# EAGLE board psion (EAGLE 9.5.0), part 1 of 2
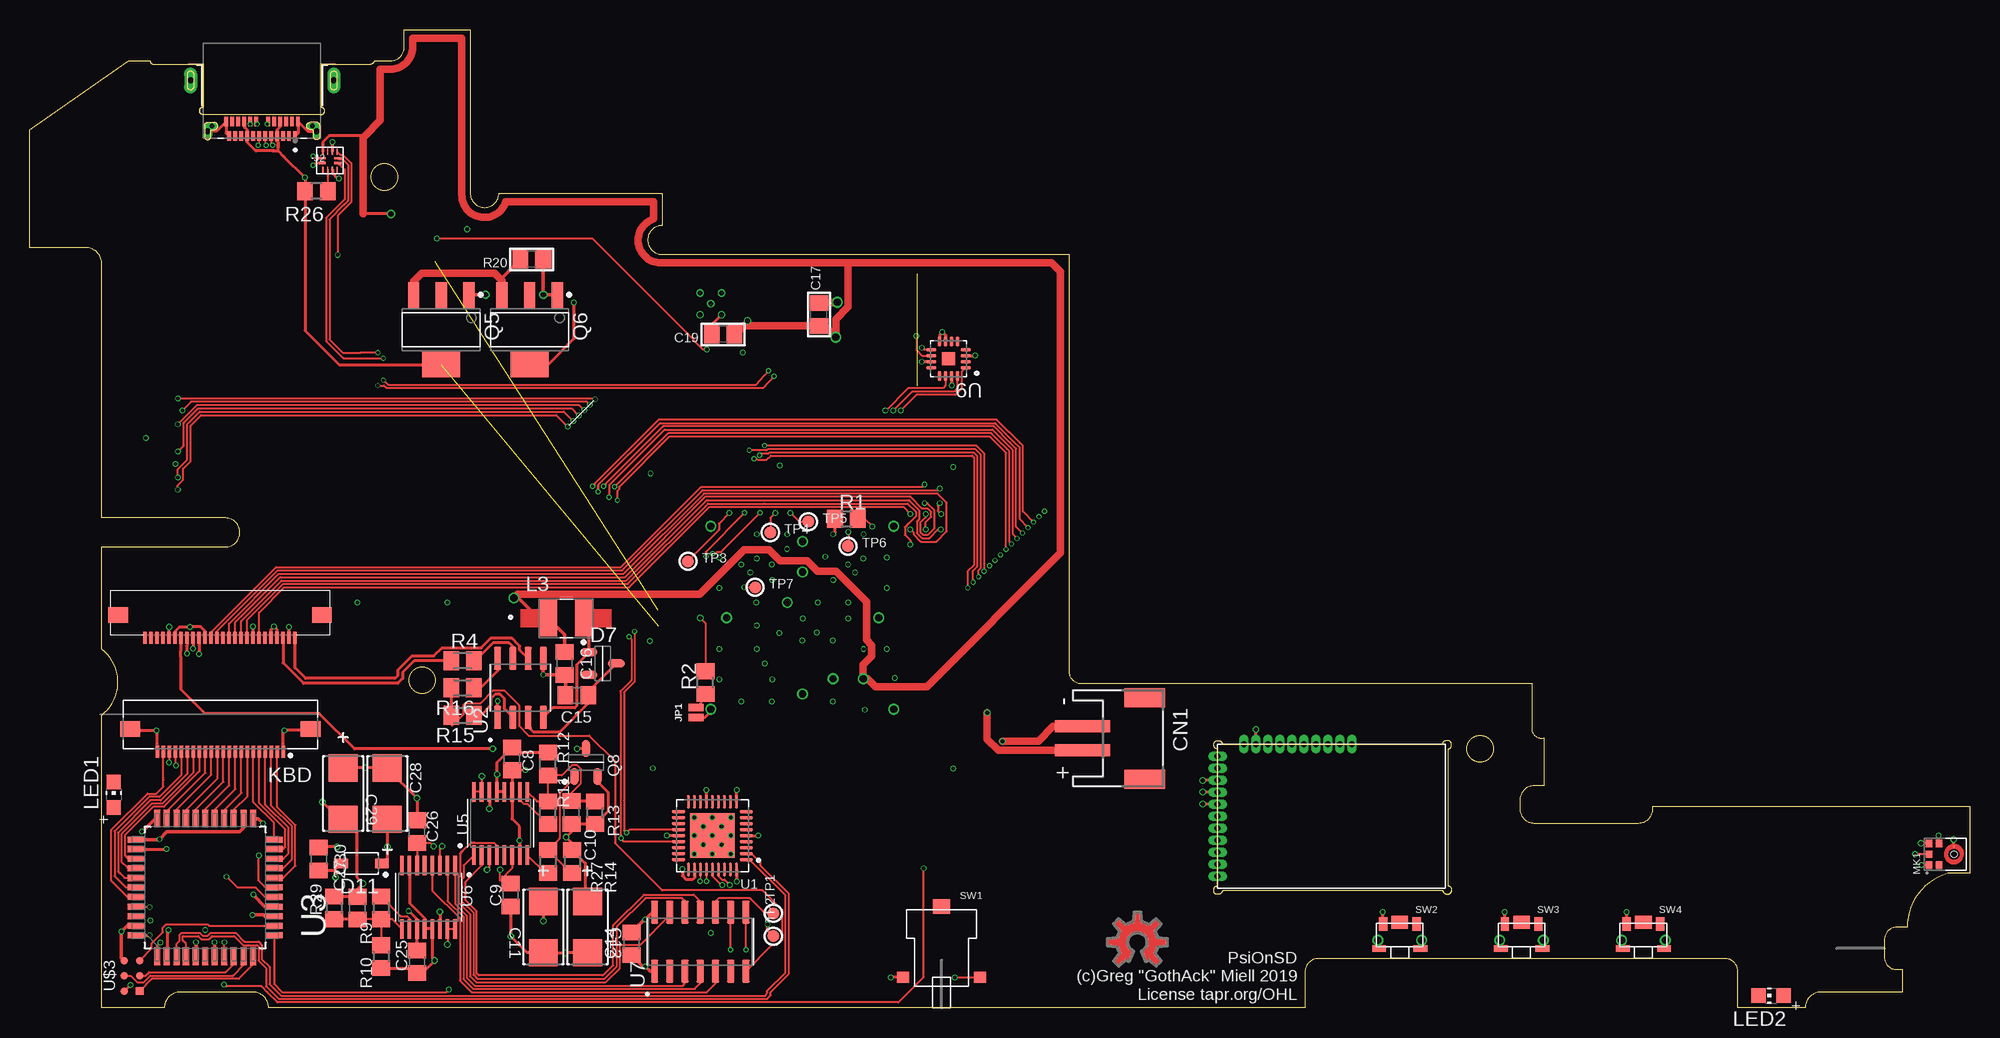
[diagram p6: board, top side]
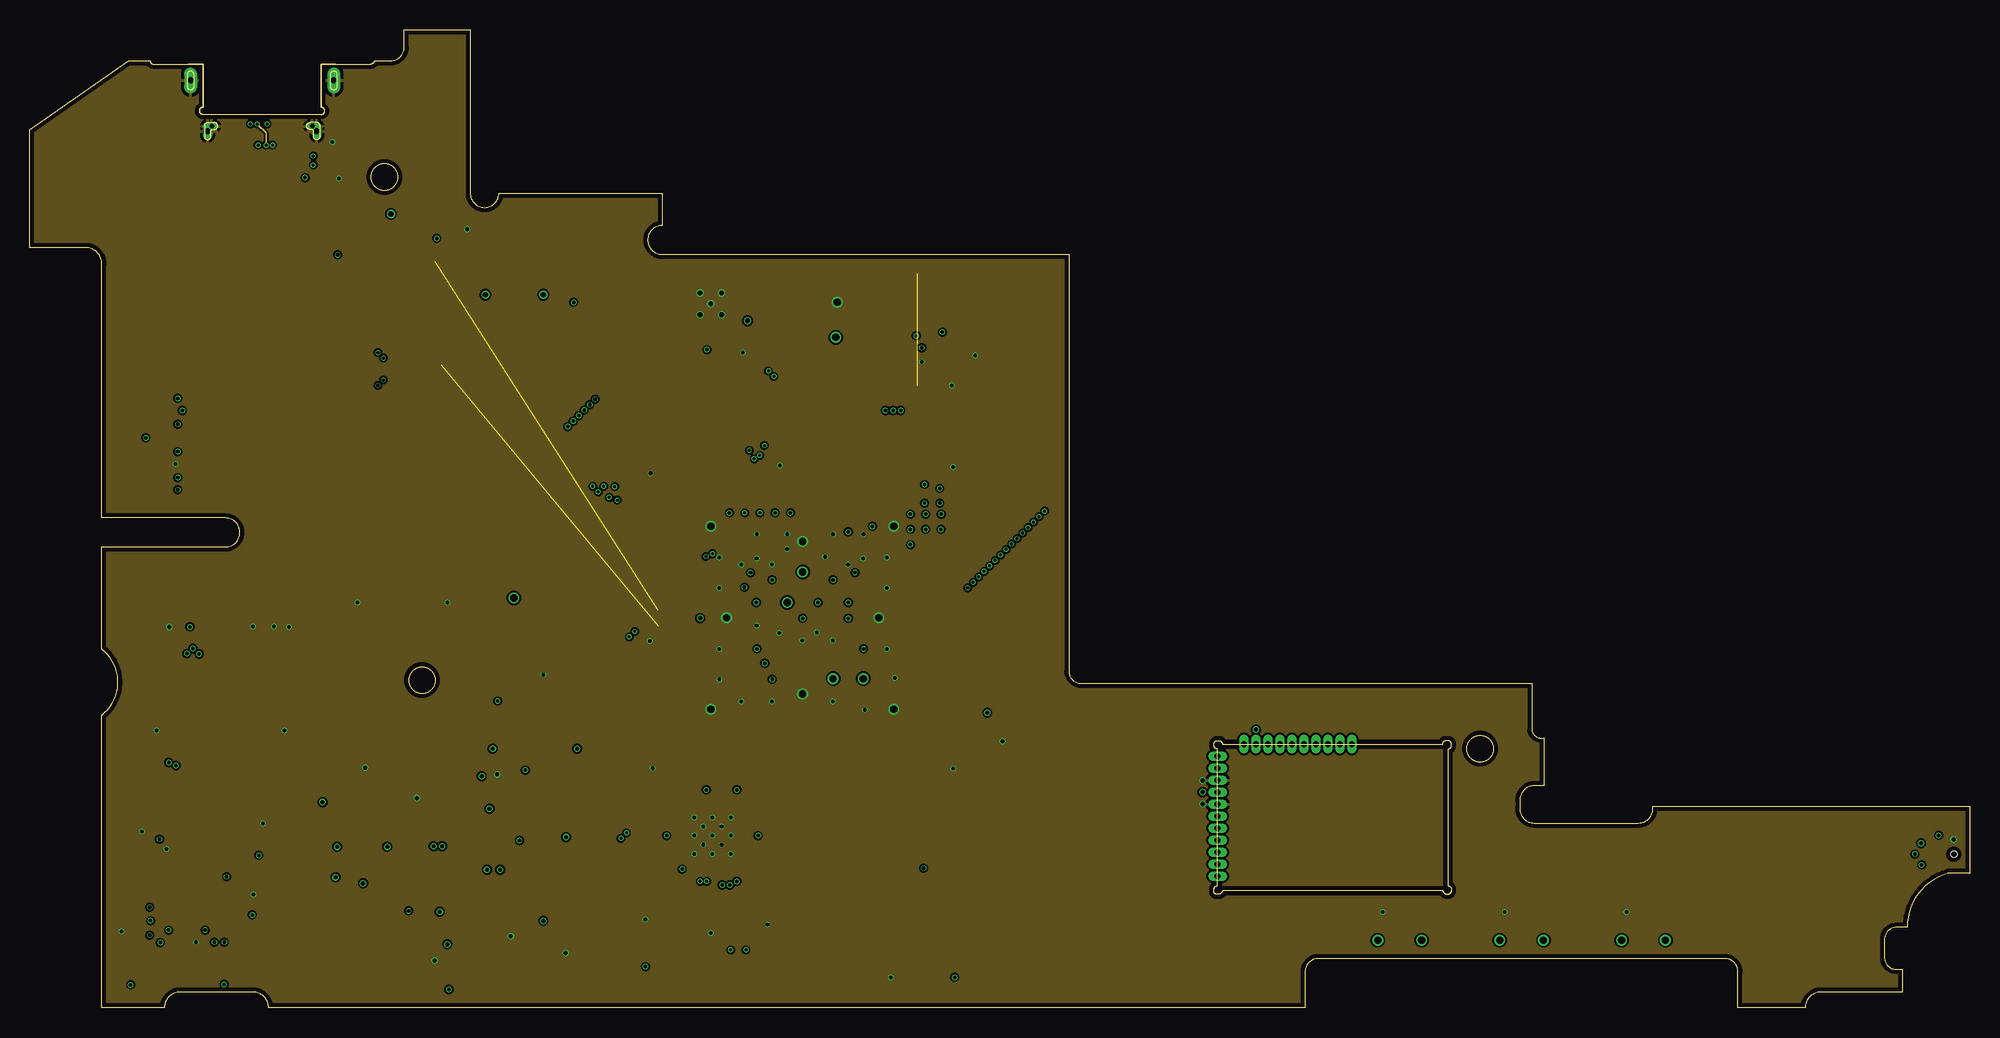
[diagram p7: board, inner layer GroundPlane]
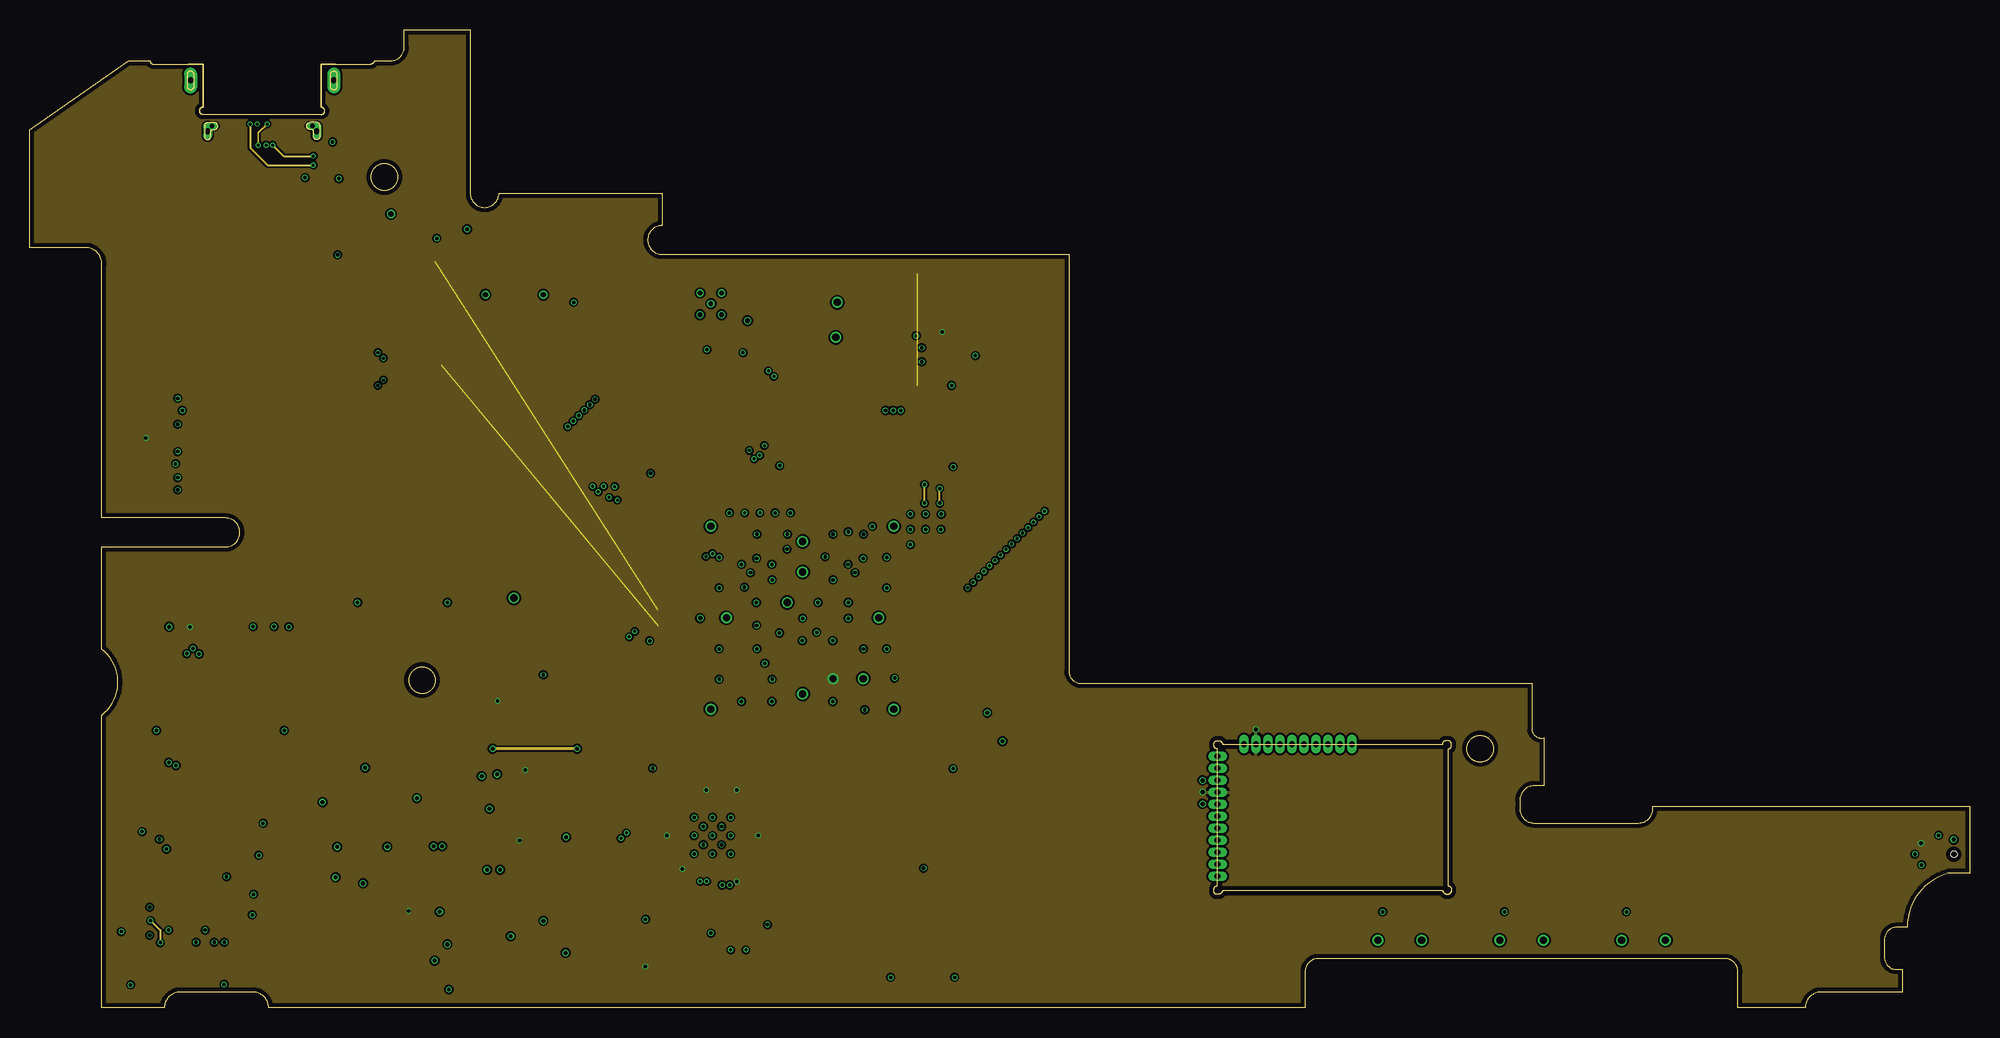
[diagram p8: board, inner layer VCC33/signal]
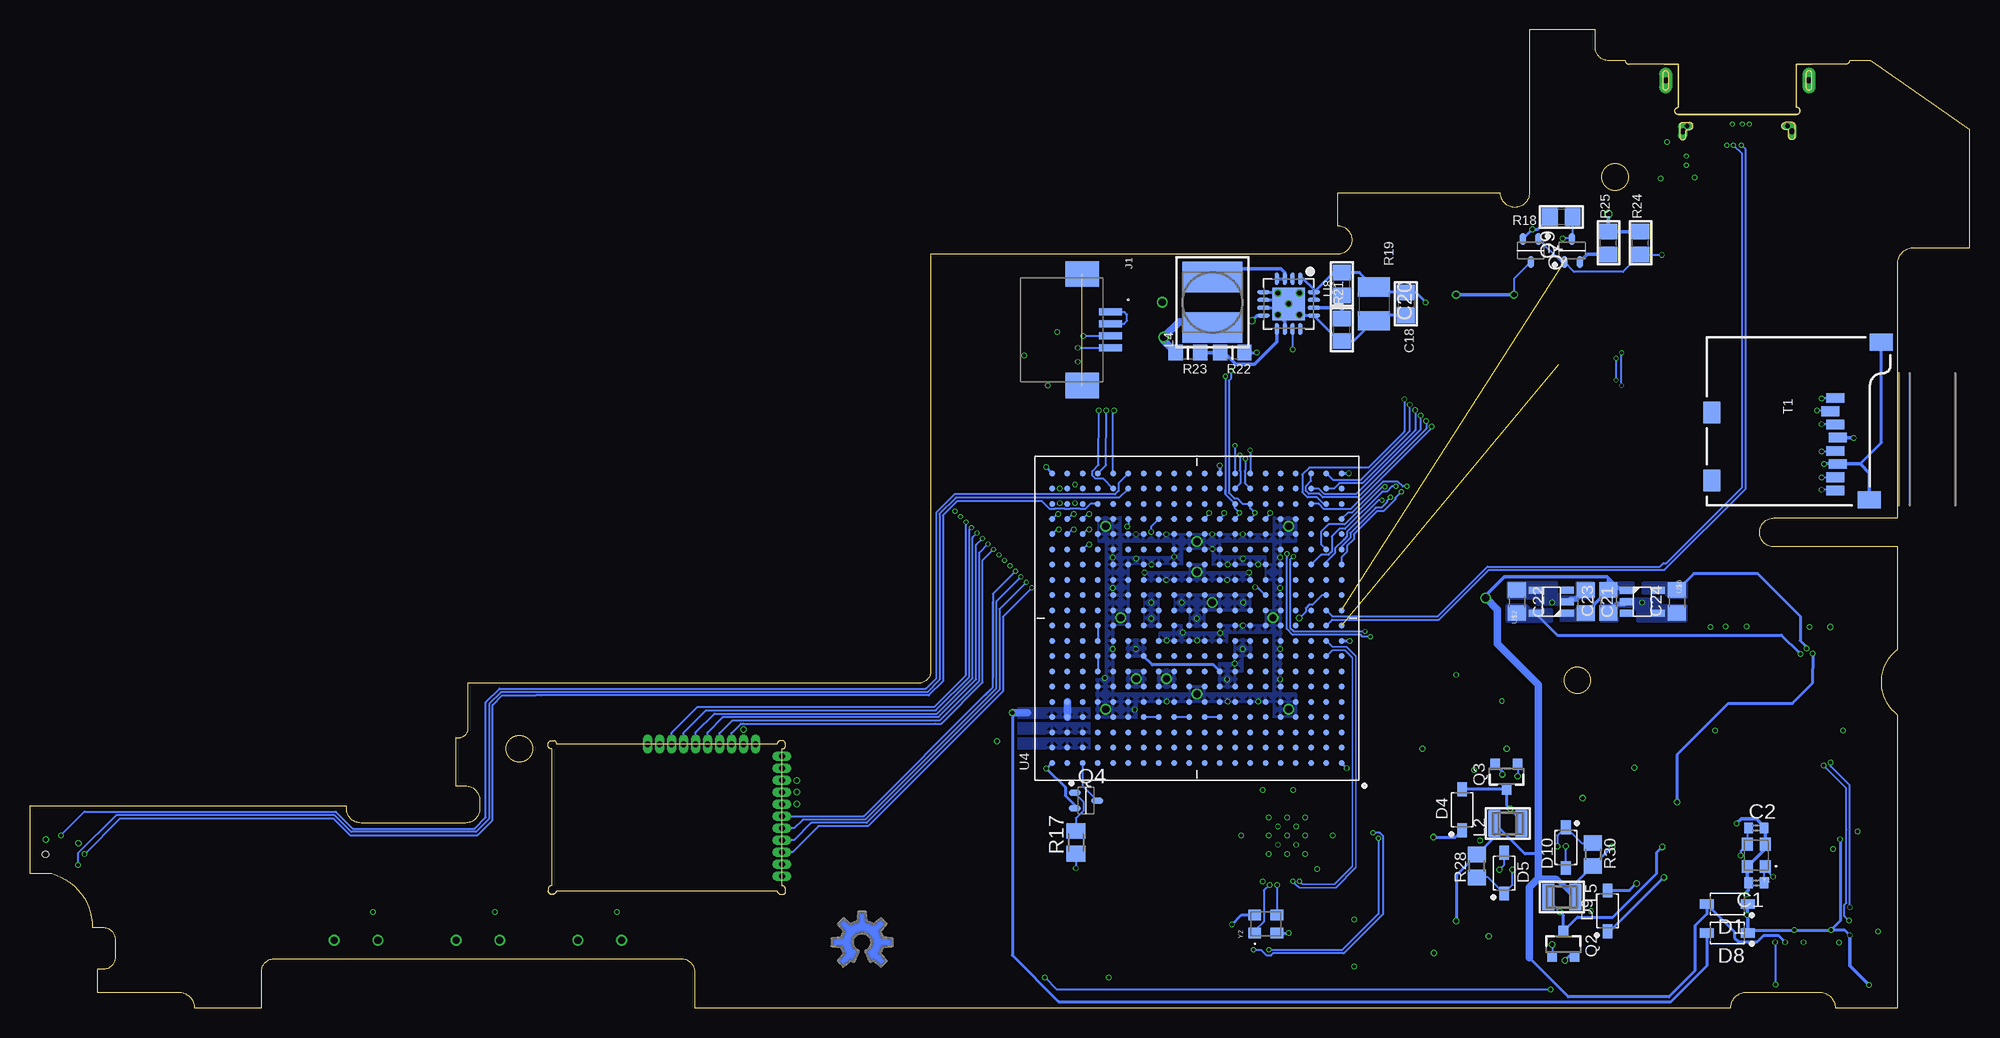
[diagram p9: board, bottom side, seen from below]

Size 161.7 x 81.5 mm. Coordinates in mm from the lower left corner, seen from the top.
Outline: 8.24,78.95 0,73.2 0,63.35 4.65,63.35 arc-90 6,62 6,40.83 16.3,40.83 arc-180 16.3,38.42 6,38.42 6,29.9 arc-104 6,24.4 6,0 11.2,0 arc-90 12.5,1.3 18.6,1.3 arc-90 19.9,0 106.3,0 106.3,3 arc-90 107.4,4.1 141.3,4.1 arc-90 142.4,3 142.4,0 148,0 arc-90 149.3,1.3 156.1,1.3 156.1,3.2 155.6,3.2 arc-90 154.6,4.2 154.6,5.7 arc-90 155.6,6.7 156.5,6.7 arc-74 159.88,11.2 161.7,11.2 161.7,16.8 135.3,16.8 135.3,16.6 arc-90 134.1,15.4 125.4,15.4 arc-90 124.2,16.6 124.2,17.3 arc-90 125.4,18.5 126.2,18.5 126.2,22.5 arc-90 125.2,23.12 125.2,27.05 87.61,27.05 arc-90 86.61,28.05 86.61,62.8 52.7,62.8 arc-180 52.7,65.2 52.7,67.9 39.1,67.9 arc-180 36.7,67.9 36.7,81.5 31.2,81.5 31.2,80.05 arc-90 30.1,78.95 28.7,78.95 arc-90 28.4,78.65 24.27,78.65 24.27,75.06 arc-90 24.57,74.76 arc-90 24.27,74.46 14.43,74.46 arc-90 14.13,74.76 14.13,74.77 arc-90 14.42,75.06 14.43,75.06 14.43,78.65 10.3,78.65 arc-90 10,78.95 8.24,78.95
Outline: 8.21,78.95 8.24,78.95
Outline: circle at 29.55,69.25 radius 1.1
Outline: circle at 32.69,27.31 radius 1.1
Outline: circle at 120.9,21.6 radius 1.1
Copper layers (1*2*15*16): Top 0.035559375mm / dielectric 0.17018125mm / GroundPlane 0.01778125mm / dielectric 47mil / VCC33/signal 0.01778125mm / dielectric 0.17018125mm / Bottom 0.035559375mm
Design rules "oshpark-4layer *": minimum track width 5mil, minimum drill 10mil, track to track 5mil, track to pad 5mil, pad to pad 5mil, via to via 5mil, smd to smd 5mil, copper to edge 15mil, drill to drill 6mil, minimum pad ring 3mil, minimum via ring 3mil, stop-mask expansion 2.5mil, vias tented up to drill 0mil, thermal gap 10mil
Net classes: 0 default: width 0.152 mm, drill 0.254 mm, clearance 0.089 mm; 1 data: width 0.152 mm, drill 0.254 mm, clearance 0.089 mm; 2 power: width 0.254 mm, drill 0.254 mm, clearance 0.152 mm; 3 data_usb: width 0.127 mm, drill 0.254 mm, clearance 0.089 mm; 4 data_lcd: width 0.152 mm, drill 0.254 mm, clearance 0.089 mm; 5 data_lowspeed: width 0.152 mm, drill 0.254 mm, clearance 0.089 mm

## Footprints (pad centres in the part's own frame; a part is rotated, then mirrored left to right if it is on the bottom)
C0402 = smd 0.7 x 0.9: 1 -0.65,0; 2 0.65,0
C805 = smd 1.3 x 1.5: 1 -0.95,0; 2 0.95,0
CAPCP6032X280N = smd 2.261 x 2.413: N 2.134,0; P -2.134,0
0805 = smd 1.3 x 1.5: 1 -0.95,0; 2 0.95,0
C1210 = smd 1.6 x 2.7: 1 -1.4,0; 2 1.4,0
JST-PH-2-SMT-RA = smd 1 x 4.6: 1 1,-3.7; 2 -1,-3.7 | smd 1.6 x 3.4: NC1 -3.4,1.5; NC2 3.4,1.5
SOD3718X135N = smd 1.15 x 0.8: A 1.7,0; K -1.7,0
SOT95P280X135-3N = smd 1.4 x 0.65: 1 -1.15,0.95; 2 -1.15,-0.95; 3 1.15,0
MOLEX_0522070433 = smd 0.6 x 1.9: 1 -1.5,0; 2 -0.5,0; 3 0.5,0; 4 1.5,0 | smd 2.1 x 2.8: S1 -4.65,-2.35; S2 4.65,-2.35
TE_1-2295018-2 = smd 0.3 x 0.8: A1 -2.75,4.63; A2 -2.25,4.63; A3 -1.75,4.63; A4 -1.25,4.63; A5 -0.75,4.63; A6 -0.25,4.63; A7 0.25,4.63; A8 0.75,4.63; A9 1.25,4.63; A10 1.75,4.63; A11 2.25,4.63; A12 2.75,4.63; B1 3,3.43; B2 2.5,3.43; B3 2,3.43; B4 1.5,3.43; B5 1,3.43; B6 0.5,3.43; B7 -0.5,3.43; B8 -1,3.43; B9 -1.5,3.43; B10 -2,3.43; B11 -2.5,3.43; B12 -3,3.43 | drill 0.5 long: P1_1 -4.55,4.22; P2_1 4.55,4.22 | drill 0.35 long: P1_2 -4.191,3.795; P2_2 4.191,3.795 | drill 0.5 pad 1.1 long: P4 -5.97,0; P5 5.97,0
SMT-JUMPER_2_NO_NO-SILK = smd 0.635 x 1.27: 1 -0.406,0; 2 0.406,0
MOLEX_54548-2271 = smd 0.3 x 1: 1 -5.25,0; 2 -4.75,0; 3 -4.25,0; 4 -3.75,0; 5 -3.25,0; 6 -2.75,0; 7 -2.25,0; 8 -1.75,0; 9 -1.25,0; 10 -0.75,0; 11 -0.25,0; 12 0.25,0; 13 0.75,0; 14 1.25,0; 15 1.75,0; 16 2.25,0; 17 2.75,0; 18 3.25,0; 19 3.75,0; 20 4.25,0; 21 4.75,0; 22 5.25,0 | smd 1.65 x 1.3: SH1 -7.525,-1.9; SH2 7.525,-1.9
INDUCTOR_1007 = smd 1.016 x 2.2: P$1 -1.127,0; P$2 1.127,0
IND_LQH43CN1R0M03L = smd 1.5 x 3: 1 -1.5,0; 2 1.5,0
INDUCTOR_5X5MM_TDK_VLC5045 = smd 2.54 x 5: P$1 -2.096,0; P$2 2.096,0
0545502671 = smd 0.3 x 1: 1 6.1,4.1; 2 6.6,4.1; 3 7.1,4.1; 4 7.6,4.1; 5 8.1,4.1; 6 8.6,4.1; 7 9.1,4.1; 8 9.6,4.1; 9 10.1,4.1; 10 10.6,4.1; 11 11.1,4.1; 12 11.6,4.1; 13 12.1,4.1; 14 12.6,4.1; 15 13.1,4.1; 16 13.6,4.1; 17 14.1,4.1; 18 14.6,4.1; 19 15.1,4.1; 20 15.6,4.1; 21 16.1,4.1; 22 16.6,4.1; 23 17.1,4.1; 24 17.6,4.1; 25 18.1,4.1; 26 18.6,4.1 | smd 1.65 x 1.3: 27 3.85,2.2; 28 20.85,2.2
CHIP-LED0805 = smd 1.2 x 1.2: A 0,-1.05; C 0,1.05
MIC_SPH0645LM4H-B = smd 0.6 x 0.522: 1 -0.9,2.074; 2 -0.9,1.252; 4 0.9,1.252; 5 0.9,2.074; 6 0,2.074 | smd 0.1 x 0.1: 3 0.65,0.02 | hole 0.5: 0,0
SOT23-3 = smd 0.8 x 0.9: 1 -0.95,-1; 2 0.95,-1; 3 0,1.1
SOT65P210X110-3N = smd 1 x 0.55: 1 -0.95,0.65; 2 -0.95,-0.65; 3 0.95,0
SOT230P700X160-4N = smd 2.15 x 0.95: 1 -2.9,2.3; 2 -2.9,0; 3 -2.9,-2.3 | smd 2.15 x 3.15: 4 2.9,0
R0805 = smd 1.3 x 1.5: 1 -0.95,0; 2 0.95,0
M0805 = smd 1.3 x 1.6: 1 -0.95,0; 2 0.95,0
_0805MP = smd 1.2 x 1.3: 1 -1.016,0; 2 1.016,0
KSM1131 = smd 1 x 0.9: 1 -3.2,0; 2 3.2,0 | smd 1.4 x 1.2: NC 0,5.9
LS12T2-T = smd 0.7 x 1.1: 1 -1.4,1.9; 2 1.4,1.9 | smd 1.4 x 1.1: NC1 0,2.05 | smd 1.15 x 0.55: NC2 -1.725,-0.125; NC3 1.725,-0.125 | drill 0.6 pad 0.762: NC4 -1.825,0.55; NC5 1.825,0.55
MICRO-SD-SOCKET-PP = smd 0.8 x 1.5: 1 -8.94,10.7; 2 -7.84,10.3; 3 -6.74,10.7; 4 -5.64,10.9; 5 -4.54,10.7; 6 -3.44,10.9; 7 -2.34,10.7; 8 -1.24,10.7 | smd 1.8 x 1.4: CD1 -2.05,0.4; CD2 -7.75,0.4 | smd 1.4 x 1.9: GND1 -13.6,14.55; GND3 -0.45,13.55
TESTPOINT_ROUND_1MM = smd 1 x 1: P$1 0,0
QFN50P600X600X100-37N = smd 1.13 x 0.26: 1 -2.82,2; 2 -2.82,1.5; 3 -2.82,1; 4 -2.82,0.5; 5 -2.82,0; 6 -2.82,-0.5; 7 -2.82,-1; 8 -2.82,-1.5; 9 -2.82,-2; 19 2.82,-2; 20 2.82,-1.5; 21 2.82,-1; 22 2.82,-0.5; 23 2.82,0; 24 2.82,0.5; 25 2.82,1; 26 2.82,1.5; 27 2.82,2 | smd 0.26 x 1.13: 10 -2,-2.82; 11 -1.5,-2.82; 12 -1,-2.82; 13 -0.5,-2.82; 14 0,-2.82; 15 0.5,-2.82; 16 1,-2.82; 17 1.5,-2.82; 18 2,-2.82; 28 2,2.82; 29 1.5,2.82; 30 1,2.82; 31 0.5,2.82; 32 0,2.82; 33 -0.5,2.82; 34 -1,2.82; 35 -1.5,2.82; 36 -2,2.82 | smd 3.7 x 3.7: 37 0,0
SOIC127P600X175-8N = smd 1.9 x 0.6: 1 -2.455,1.905; 2 -2.455,0.635; 3 -2.455,-0.635; 4 -2.455,-1.905; 5 2.455,-1.905; 6 2.455,-0.635; 7 2.455,0.635; 8 2.455,1.905
QFP80P1200X1200X120-44N = smd 1.473 x 0.508: 1 -5.74,3.988; 2 -5.74,3.2; 3 -5.74,2.388; 4 -5.74,1.6; 5 -5.74,0.787; 6 -5.74,0; 7 -5.74,-0.787; 8 -5.74,-1.6; 9 -5.74,-2.388; 10 -5.74,-3.2; 11 -5.74,-3.988; 23 5.74,-3.988; 24 5.74,-3.2; 25 5.74,-2.388; 26 5.74,-1.6; 27 5.74,-0.787; 28 5.74,0; 29 5.74,0.787; 30 5.74,1.6; 31 5.74,2.388; 32 5.74,3.2; 33 5.74,3.988 | smd 0.508 x 1.473: 12 -3.988,-5.74; 13 -3.2,-5.74; 14 -2.388,-5.74; 15 -1.6,-5.74; 16 -0.787,-5.74; 17 0,-5.74; 18 0.787,-5.74; 19 1.6,-5.74; 20 2.388,-5.74; 21 3.2,-5.74; 22 3.988,-5.74; 34 3.988,5.74; 35 3.2,5.74; 36 2.388,5.74; 37 1.6,5.74; 38 0.787,5.74; 39 0,5.74; 40 -0.787,5.74; 41 -1.6,5.74; 42 -2.388,5.74; 43 -3.2,5.74; 44 -3.988,5.74
OSD335X-BGA-400 = smd 0.5 x 0.5: A1 -12.065,-12.065; A2 -12.065,-10.795; A3 -12.065,-9.525; A4 -12.065,-8.255; A5 -12.065,-6.985; A6 -12.065,-5.715; A7 -12.065,-4.445; A8 -12.065,-3.175; A9 -12.065,-1.905; A10 -12.065,-0.635; A11 -12.065,0.635; A12 -12.065,1.905; A13 -12.065,3.175; A14 -12.065,4.445; A15 -12.065,5.715; A16 -12.065,6.985; A17 -12.065,8.255; A18 -12.065,9.525; A19 -12.065,10.795; A20 -12.065,12.065; B1 -10.795,-12.065; B2 -10.795,-10.795; B3 -10.795,-9.525; B4 -10.795,-8.255; B5 -10.795,-6.985; B6 -10.795,-5.715; B7 -10.795,-4.445; B8 -10.795,-3.175; B9 -10.795,-1.905; B10 -10.795,-0.635; B11 -10.795,0.635; B12 -10.795,1.905; B13 -10.795,3.175; B14 -10.795,4.445; B15 -10.795,5.715; B16 -10.795,6.985; B17 -10.795,8.255; B18 -10.795,9.525; B19 -10.795,10.795; B20 -10.795,12.065; C1 -9.525,-12.065; C2 -9.525,-10.795; C3 -9.525,-9.525; C4 -9.525,-8.255; C5 -9.525,-6.985; C6 -9.525,-5.715; C7 -9.525,-4.445; C8 -9.525,-3.175; C9 -9.525,-1.905; C10 -9.525,-0.635; C11 -9.525,0.635; C12 -9.525,1.905; C13 -9.525,3.175; C14 -9.525,4.445; C15 -9.525,5.715; C16 -9.525,6.985; C17 -9.525,8.255; C18 -9.525,9.525; C19 -9.525,10.795; C20 -9.525,12.065; D1 -8.255,-12.065; D2 -8.255,-10.795; D3 -8.255,-9.525; D4 -8.255,-8.255; D5 -8.255,-6.985; D6 -8.255,-5.715; D7 -8.255,-4.445; D8 -8.255,-3.175; D9 -8.255,-1.905; D10 -8.255,-0.635; D11 -8.255,0.635; D12 -8.255,1.905; D13 -8.255,3.175; D14 -8.255,4.445; D15 -8.255,5.715; D16 -8.255,6.985; D17 -8.255,8.255; D18 -8.255,9.525; D19 -8.255,10.795; D20 -8.255,12.065; E1 -6.985,-12.065; E2 -6.985,-10.795; E3 -6.985,-9.525; E4 -6.985,-8.255; E5 -6.985,-6.985; E6 -6.985,-5.715; E7 -6.985,-4.445; E8 -6.985,-3.175; E9 -6.985,-1.905; E10 -6.985,-0.635; E11 -6.985,0.635; E12 -6.985,1.905; E13 -6.985,3.175; E14 -6.985,4.445; E15 -6.985,5.715; E16 -6.985,6.985; E17 -6.985,8.255; E18 -6.985,9.525; E19 -6.985,10.795; E20 -6.985,12.065; F1 -5.715,-12.065; F2 -5.715,-10.795; F3 -5.715,-9.525; F4 -5.715,-8.255; F5 -5.715,-6.985; F6 -5.715,-5.715; F7 -5.715,-4.445; F8 -5.715,-3.175; F9 -5.715,-1.905; F10 -5.715,-0.635; F11 -5.715,0.635; F12 -5.715,1.905; F13 -5.715,3.175; F14 -5.715,4.445; F15 -5.715,5.715; F16 -5.715,6.985; F17 -5.715,8.255; F18 -5.715,9.525; F19 -5.715,10.795; F20 -5.715,12.065; G1 -4.445,-12.065; G2 -4.445,-10.795; G3 -4.445,-9.525; G4 -4.445,-8.255; G5 -4.445,-6.985; G6 -4.445,-5.715; G7 -4.445,-4.445; G8 -4.445,-3.175; G9 -4.445,-1.905; G10 -4.445,-0.635; G11 -4.445,0.635; G12 -4.445,1.905; G13 -4.445,3.175; G14 -4.445,4.445; G15 -4.445,5.715; G16 -4.445,6.985; G17 -4.445,8.255; G18 -4.445,9.525; G19 -4.445,10.795; G20 -4.445,12.065; H1 -3.175,-12.065; H2 -3.175,-10.795; H3 -3.175,-9.525; H4 -3.175,-8.255; H5 -3.175,-6.985; H6 -3.175,-5.715; H7 -3.175,-4.445; H8 -3.175,-3.175; H9 -3.175,-1.905; H10 -3.175,-0.635; H11 -3.175,0.635; H12 -3.175,1.905; H13 -3.175,3.175; H14 -3.175,4.445; H15 -3.175,5.715; H16 -3.175,6.985; H17 -3.175,8.255; H18 -3.175,9.525; H19 -3.175,10.795; H20 -3.175,12.065; J1 -1.905,-12.065; J2 -1.905,-10.795; J3 -1.905,-9.525; J4 -1.905,-8.255; J5 -1.905,-6.985; J6 -1.905,-5.715; J7 -1.905,-4.445; J8 -1.905,-3.175; J9 -1.905,-1.905; J10 -1.905,-0.635; J11 -1.905,0.635; J12 -1.905,1.905; J13 -1.905,3.175; J14 -1.905,4.445; J15 -1.905,5.715; J16 -1.905,6.985; J17 -1.905,8.255; J18 -1.905,9.525; J19 -1.905,10.795; J20 -1.905,12.065; K1 -0.635,-12.065; K2 -0.635,-10.795; K3 -0.635,-9.525; K4 -0.635,-8.255; K5 -0.635,-6.985; K6 -0.635,-5.715; K7 -0.635,-4.445; K8 -0.635,-3.175; K9 -0.635,-1.905; K10 -0.635,-0.635; K11 -0.635,0.635; K12 -0.635,1.905; K13 -0.635,3.175; K14 -0.635,4.445; K15 -0.635,5.715; K16 -0.635,6.985; K17 -0.635,8.255; K18 -0.635,9.525; K19 -0.635,10.795; K20 -0.635,12.065; L1 0.635,-12.065; L2 0.635,-10.795; L3 0.635,-9.525; L4 0.635,-8.255; L5 0.635,-6.985; L6 0.635,-5.715; L7 0.635,-4.445; L8 0.635,-3.175; L9 0.635,-1.905; L10 0.635,-0.635; L11 0.635,0.635; L12 0.635,1.905; L13 0.635,3.175; L14 0.635,4.445; L15 0.635,5.715; L16 0.635,6.985; L17 0.635,8.255; L18 0.635,9.525; L19 0.635,10.795; L20 0.635,12.065; M1 1.905,-12.065; M2 1.905,-10.795; M3 1.905,-9.525; M4 1.905,-8.255; M5 1.905,-6.985; M6 1.905,-5.715; M7 1.905,-4.445; M8 1.905,-3.175; M9 1.905,-1.905; M10 1.905,-0.635; M11 1.905,0.635; M12 1.905,1.905; M13 1.905,3.175; M14 1.905,4.445; M15 1.905,5.715; M16 1.905,6.985; M17 1.905,8.255; M18 1.905,9.525; M19 1.905,10.795; M20 1.905,12.065; N1 3.175,-12.065; N2 3.175,-10.795; N3 3.175,-9.525; N4 3.175,-8.255; N5 3.175,-6.985; N6 3.175,-5.715; N7 3.175,-4.445; N8 3.175,-3.175; N9 3.175,-1.905; N10 3.175,-0.635; N11 3.175,0.635; N12 3.175,1.905; N13 3.175,3.175; N14 3.175,4.445; N15 3.175,5.715; N16 3.175,6.985; N17 3.175,8.255; N18 3.175,9.525; N19 3.175,10.795; N20 3.175,12.065; P1 4.445,-12.065; P2 4.445,-10.795; P3 4.445,-9.525; P4 4.445,-8.255; P5 4.445,-6.985; P6 4.445,-5.715; P7 4.445,-4.445; P8 4.445,-3.175; P9 4.445,-1.905; P10 4.445,-0.635; P11 4.445,0.635; P12 4.445,1.905; P13 4.445,3.175; P14 4.445,4.445; P15 4.445,5.715; P16 4.445,6.985; P17 4.445,8.255; P18 4.445,9.525; P19 4.445,10.795; P20 4.445,12.065; R1 5.715,-12.065; R2 5.715,-10.795; R3 5.715,-9.525; R4 5.715,-8.255; R5 5.715,-6.985; R6 5.715,-5.715; R7 5.715,-4.445; R8 5.715,-3.175; R9 5.715,-1.905; R10 5.715,-0.635; R11 5.715,0.635; R12 5.715,1.905; R13 5.715,3.175; R14 5.715,4.445; R15 5.715,5.715; R16 5.715,6.985; R17 5.715,8.255; R18 5.715,9.525; R19 5.715,10.795; R20 5.715,12.065; T1 6.985,-12.065; T2 6.985,-10.795; T3 6.985,-9.525; T4 6.985,-8.255; T5 6.985,-6.985; T6 6.985,-5.715; T7 6.985,-4.445; T8 6.985,-3.175; T9 6.985,-1.905; T10 6.985,-0.635; T11 6.985,0.635; T12 6.985,1.905; T13 6.985,3.175; T14 6.985,4.445; T15 6.985,5.715; T16 6.985,6.985; T17 6.985,8.255; T18 6.985,9.525; T19 6.985,10.795; T20 6.985,12.065; U1 8.255,-12.065; U2 8.255,-10.795; U3 8.255,-9.525; U4 8.255,-8.255; U5 8.255,-6.985; U6 8.255,-5.715; U7 8.255,-4.445; U8 8.255,-3.175; U9 8.255,-1.905; U10 8.255,-0.635; U11 8.255,0.635; U12 8.255,1.905; U13 8.255,3.175; U14 8.255,4.445; U15 8.255,5.715; U16 8.255,6.985; U17 8.255,8.255; U18 8.255,9.525; U19 8.255,10.795; U20 8.255,12.065; V1 9.525,-12.065; V2 9.525,-10.795; V3 9.525,-9.525; V4 9.525,-8.255; V5 9.525,-6.985; V6 9.525,-5.715; V7 9.525,-4.445; V8 9.525,-3.175; V9 9.525,-1.905; V10 9.525,-0.635; V11 9.525,0.635; V12 9.525,1.905; V13 9.525,3.175; V14 9.525,4.445; V15 9.525,5.715; V16 9.525,6.985; V17 9.525,8.255; V18 9.525,9.525; V19 9.525,10.795; V20 9.525,12.065; W1 10.795,-12.065; W2 10.795,-10.795; W3 10.795,-9.525; W4 10.795,-8.255; W5 10.795,-6.985; W6 10.795,-5.715; W7 10.795,-4.445; W8 10.795,-3.175; W9 10.795,-1.905; W10 10.795,-0.635; W11 10.795,0.635; W12 10.795,1.905; W13 10.795,3.175; W14 10.795,4.445; W15 10.795,5.715; W16 10.795,6.985; W17 10.795,8.255; W18 10.795,9.525; W19 10.795,10.795; W20 10.795,12.065; Y1 12.065,-12.065; Y2 12.065,-10.795; Y3 12.065,-9.525; Y4 12.065,-8.255; Y5 12.065,-6.985; Y6 12.065,-5.715; Y7 12.065,-4.445; Y8 12.065,-3.175; Y9 12.065,-1.905; Y10 12.065,-0.635; Y11 12.065,0.635; Y12 12.065,1.905; Y13 12.065,3.175; Y14 12.065,4.445; Y15 12.065,5.715; Y16 12.065,6.985; Y17 12.065,8.255; Y18 12.065,9.525; Y19 12.065,10.795; Y20 12.065,12.065
SOP63P602X175-16N = smd 1.64 x 0.41: 1 -2.635,2.223; 2 -2.635,1.587; 3 -2.635,0.953; 4 -2.635,0.318; 5 -2.635,-0.318; 6 -2.635,-0.953; 7 -2.635,-1.587; 8 -2.635,-2.223; 9 2.635,-2.223; 10 2.635,-1.587; 11 2.635,-0.953; 12 2.635,-0.318; 13 2.635,0.318; 14 2.635,0.953; 15 2.635,1.587; 16 2.635,2.223
SOIC127P600X175-14N = smd 1.9 x 0.6: 1 -2.455,3.81; 2 -2.455,2.54; 3 -2.455,1.27; 4 -2.455,0; 5 -2.455,-1.27; 6 -2.455,-2.54; 7 -2.455,-3.81; 8 2.455,-3.81; 9 2.455,-2.54; 10 2.455,-1.27; 11 2.455,0; 12 2.455,1.27; 13 2.455,2.54; 14 2.455,3.81
PVQFN-16 = smd 1.05 x 0.35: 1 -2.1,0.975; 2 -2.1,0.325; 3 -2.1,-0.325; 4 -2.1,-0.975; 9 2.1,-0.975; 10 2.1,-0.325; 11 2.1,0.325; 12 2.1,0.975 | smd 0.35 x 1.05: 5 -0.975,-2.1; 6 -0.325,-2.1; 7 0.325,-2.1; 8 0.975,-2.1; 13 0.975,2.1; 14 0.325,2.1; 15 -0.325,2.1; 16 -0.975,2.1 | drill 0.4: P$18 0,0; P$19 -0.9,0.9; P$20 0.9,0.9; P$21 0.9,-0.9; P$22 -0.9,-0.9 | smd 2.7 x 2.7: THERMAL 0,0
QFN50P300X300X80-17N = smd 0.86 x 0.27: 1 -1.435,0.75; 2 -1.435,0.25; 3 -1.435,-0.25; 4 -1.435,-0.75; 9 1.435,-0.75; 10 1.435,-0.25; 11 1.435,0.25; 12 1.435,0.75 | smd 0.27 x 0.86: 5 -0.75,-1.435; 6 -0.25,-1.435; 7 0.25,-1.435; 8 0.75,-1.435; 13 0.75,1.435; 14 0.25,1.435; 15 -0.25,1.435; 16 -0.75,1.435 | smd 1.1 x 1.1: 17 0,0
LM832SMT_EMB = drill 0.5 pad 0.8 long: 1 0,11.2; 2 0,10.2; 3 0,9.2; 4 0,8.2; 5 0,7.2; 6 0,6.2; 7 0,5.2; 8 0,4.2; 9 0,3.2; 10 0,2.2; 11 1,0; 12 2,0; 13 3,0; 14 4,0; 15 5,0; 16 6,0; 17 7,0; 18 8,0; 19 9,0; 20 10,0; 21 11,0
SOT23-5 = smd 0.6 x 1.05: 1 0,-2.7; 2 0.95,-2.7; 3 1.9,-2.7; 4 1.9,0; 5 0,0
1.27MM-ICSP = smd 0.635 x 0.635: +V 0,1.27; GND 2.54,1.27; MISO 0,0; MOSI 1.27,1.27; RST 2.54,0; SCK 1.27,0
X2QFN = smd 0.7 x 0.2: P$1 -0.65,0.2; P$2 -0.65,-0.2; P$7 0.65,-0.2; P$8 0.65,0.2 | smd 0.2 x 0.5: P$3 -0.6,-0.75; P$4 -0.2,-0.75; P$5 0.2,-0.75; P$6 0.6,-0.75; P$9 0.6,0.75; P$10 0.2,0.75; P$11 -0.2,0.75; P$12 -0.6,0.75
XTAL250X200X50 = smd 0.91 x 1.06: 1 -0.75,0.925; 2 -0.75,-0.925; 3 0.75,-0.925; 4 0.75,0.925

## Placement (x,y rotation side)
C1  15pf  [C0402]  17.78,10.41 180 bottom
C2  15pf  [C0402]  17.78,14.99 0 bottom
C8  0.1uf  [C805]  40.18,20.75 90 top
C9  0.1uf  [C805]  40.08,9.4 270 top
C10  100pf  [C805]  45.16,16.28 270 top
C11  22uf  [CAPCP6032X280N]  42.8,6.73 270 top
C12  22uf  [CAPCP6032X280N]  46.48,6.73 270 top
C14  0.1uf  [C805]  50.16,5.33 90 top
C15  0.01uf 100V  [C805]  45.59,26.04 180 top
C16  0.1uf  [C805]  44.58,28.7 270 top
C17  10uF  [0805]  65.79,57.78 90 top
C18  2.2uF  [0805]  46.99,58.67 270 bottom
C19  0.1uF  [0805]  57.78,56.13 180 top
C20  100uF  [C1210]  49.66,58.67 270 bottom
C21  1uf  [C805]  32,33.86 270 bottom
C22  1uf  [C805]  37.72,33.86 270 bottom
C23  1uf  [C805]  30.1,33.86 90 bottom
C24  1uf  [C805]  24.38,33.86 90 bottom
C25  0.1uf  [C805]  32.28,3.84 270 top
C26  0.1uf  [C805]  32.26,14.68 90 top
C27  100pf  [C805]  27.3,8.31 90 top
C28  22uf  [CAPCP6032X280N]  29.79,17.86 90 top
C29  22uf  [CAPCP6032X280N]  26.11,17.86 270 top
C30  100pf  [C805]  24.08,12.4 270 top
CN1  [JST-PH-2-SMT-RA]  91.44,22.45 270 top
D1  [SOD3718X135N]  20.19,8.64 180 bottom
D4  MBRS0540  [SOD3718X135N]  42.29,16.51 90 bottom
D5  MBRS0540  [SOD3718X135N]  38.81,11.23 90 bottom
D7  MMBD914-E3-18  [SOT95P280X135-3N]  47.75,28.7 0 top
D8  [SOD3718X135N]  20.19,6.22 180 bottom
D9  MBRS0540  [SOD3718X135N]  30.18,8.08 90 bottom
D10  MBRS0540  [SOD3718X135N]  33.66,13.36 270 bottom
D11  MBRS0540  [SOD3718X135N]  27.64,12.01 180 top
J1  0522070433  [MOLEX_0522070433]  71.63,56.52 270 bottom
J2  1-2295018-2  [TE_1-2295018-2]  19.35,77.29 180 top
JP1  JUMPER-SMT_2_NO_NO-SILK  [SMT-JUMPER_2_NO_NO-SILK]  55.52,24.61 90 top
KBD  54548-2271  [MOLEX_54548-2271]  15.88,21.34 180 top
L2  LQH2MCN270K02L  [INDUCTOR_1007]  38.48,15.37 0 bottom
L3  LQH43NN561J03L  [IND_LQH43CN1R0M03L]  44.7,32.46 0 top
L4  6.8uH  [INDUCTOR_5X5MM_TDK_VLC5045]  63.12,58.8 90 bottom
L5  LQH2MCN270K02L  [INDUCTOR_1007]  33.99,9.22 180 bottom
LCD  0545502671  [0545502671]  28.19,34.92 180 top
LED1  [CHIP-LED0805]  6.99,17.75 0 top
LED2  [CHIP-LED0805]  145.16,1.02 90 top
MK1  SPH0645LM4H-B  [MIC_SPH0645LM4H-B]  160.4,12.8 90 top
Q2  NTF3055L108T1G  [SOT23-3]  33.86,5.28 0 bottom
Q3  NTF3055L108T1G  [SOT23-3]  38.61,19.3 180 bottom
Q4  [SOT65P210X110-3N]  73.66,17.27 0 bottom
Q5  MOSFET-PCH_SOT-223  [SOT230P700X160-4N]  34.29,56.52 270 top
Q6  MOSFET-PCH_SOT-223  [SOT230P700X160-4N]  41.66,56.52 270 top
Q7  [SOT65P210X110-3N]  36.58,63.12 270 bottom
Q8  MMBT2907ALT1G  [SOT95P280X135-3N]  46.35,20.45 90 top
Q9  [SOT65P210X110-3N]  33.15,63.12 90 bottom
R1  [R0805]  68.07,40.77 0 top
R2  [R0805]  56.31,27.1 90 top
R4  100  [M0805]  36.07,28.93 0 top
R9  1M  [R0805]  29.29,8.33 270 top
R10  300k  [R0805]  29.29,4.27 270 top
R11  1M  [R0805]  43.18,16.26 90 top
R12  300k  [R0805]  43.18,20.32 90 top
R13  3.3M  [R0805]  47.12,16.26 90 top
R14  2.2M  [R0805]  45.21,12.19 270 top
R15  330k  [M0805]  36.07,24.38 180 top
R16  2M  [M0805]  36.07,26.67 180 top
R17  1k  [M0805]  74.5,13.79 90 bottom
R18  200K  [0805]  34.04,65.91 180 bottom
R19  1.87M  [0805]  52.32,60.33 90 bottom
R20  200K  [0805]  41.83,62.38 180 top
R21  200K  [0805]  52.32,56.52 90 bottom
R22  340K  [_0805MP]  61.47,54.61 180 bottom
R23  1.87M  [_0805MP]  65.15,54.61 180 bottom
R24  200K  [0805]  27.43,63.75 90 bottom
R25  10k  [0805]  30.1,63.75 90 bottom
R26  900k  [R0805]  23.88,68.07 180 top
R27  2.2M  [R0805]  43.18,12.19 270 top
R28  10k  [R0805]  41.07,11.81 90 bottom
R29  3.3M  [R0805]  25.35,8.33 270 top
R30  10k  [R0805]  31.39,12.78 270 bottom
SW1  KSM1131  [KSM1131]  76,2.54 0 top
SW2  LS12T2-T  [LS12T2-T]  114.2,5.08 0 top
SW3  LS12T2-T  [LS12T2-T]  124.36,5.08 0 top
SW4  LS12T2-T  [LS12T2-T]  134.52,5.08 0 top
T1  2908-05WB-MG  [MICRO-SD-SOCKET-PP]  21.89,41.88 270 bottom
TP1  [TESTPOINT_ROUND_1MM]  61.98,7.87 90 top
TP2  [TESTPOINT_ROUND_1MM]  61.98,5.97 90 top
TP3  [TESTPOINT_ROUND_1MM]  54.86,37.21 0 top
TP4  [TESTPOINT_ROUND_1MM]  61.72,39.62 0 top
TP5  [TESTPOINT_ROUND_1MM]  64.9,40.51 0 top
TP6  [TESTPOINT_ROUND_1MM]  68.2,38.48 0 top
TP7  [TESTPOINT_ROUND_1MM]  60.45,35.05 0 top
U1  USB2514BI-AEZG  [QFN50P600X600X100-37N]  56.9,14.35 180 top
U2  HV823LG-G  [SOIC127P600X175-8N]  40.89,26.67 90 top
U3  ATMEGA32U4-AU  [QFP80P1200X1200X120-44N]  14.61,10.03 90 top
U4  OSD3358-512M-BCB  [OSD335X-BGA-400]  64.41,32.49 90 bottom
U5  MAX1620EEE+  [SOP63P602X175-16N]  39.24,15.37 90 top
U6  MAX1620EEE+  [SOP63P602X175-16N]  33.22,9.22 270 top
U7  ATTINY404-SSN  [SOIC127P600X175-14N]  55.88,5.51 90 top
U8  TPS61090RSAR  [PVQFN-16]  56.77,58.67 270 bottom
U9  MAX98357AETE+  [QFN50P300X300X80-17N]  76.58,54.1 180 top
U$1  LM832EMBEDDED  [LM832SMT_EMB]  99.01,21.97 270 top
U$2  TLV70233PDBVR  [SOT23-5]  36.2,32.89 90 bottom
U$3  1.27MM-ICSP  [1.27MM-ICSP]  9.14,1.4 90 top
U$4  TUSB320XQFN  [X2QFN]  25.02,70.61 0 top
U$5  [OSHWLOGO_TOP_0.2]  92.33,5.46 0 top
U$6  TLV70233PDBVR  [SOT23-5]  25.91,34.8 270 bottom
U$7  [OSHWLOGO_TOP_0.2]  92.33,5.46 0 bottom
Y1  ABM10-16.000MHZ-D30-T3  [XTAL250X200X50]  17.78,12.7 180 bottom
Y2  ABM10-24.000MHZ-E20-T  [XTAL250X200X50]  58.67,6.99 90 bottom